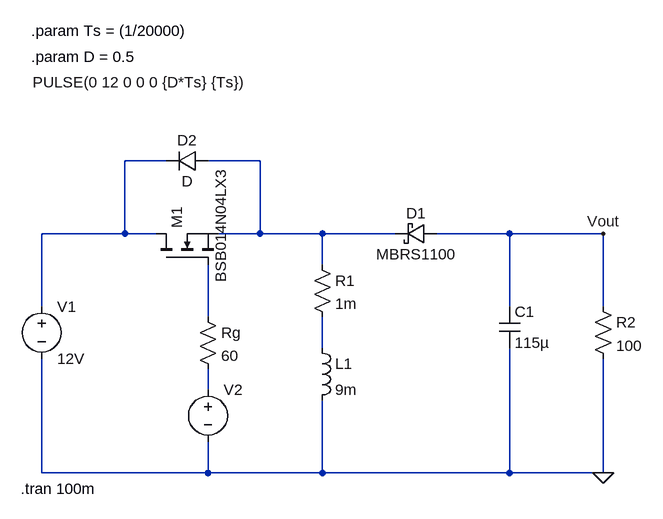
[diagram p0: schematic BuckBoost_gizemfiliz.asc]
BuckBoost_gizemfiliz.asc, the LTspice schematic file:
Version 4
SHEET 1 880 680
WIRE 128 -96 64 -96
WIRE 272 -96 192 -96
WIRE 64 16 64 -96
WIRE 64 16 -64 16
WIRE 112 16 64 16
WIRE 272 16 272 -96
WIRE 272 16 208 16
WIRE 368 16 272 16
WIRE 480 16 368 16
WIRE 656 16 544 16
WIRE 800 16 656 16
WIRE 368 64 368 16
WIRE -64 128 -64 16
WIRE 656 128 656 16
WIRE 800 128 800 16
WIRE 192 144 192 64
WIRE 368 192 368 144
WIRE 192 256 192 224
WIRE -64 384 -64 208
WIRE 192 384 192 336
WIRE 192 384 -64 384
WIRE 368 384 368 272
WIRE 368 384 192 384
WIRE 656 384 656 192
WIRE 656 384 368 384
WIRE 800 384 800 208
WIRE 800 384 656 384
FLAG 800 384 0
FLAG 800 16 Vout
SYMBOL voltage -64 112 R0
WINDOW 123 0 0 Left 0
WINDOW 39 0 0 Left 0
SYMATTR InstName V1
SYMATTR Value 12V
SYMBOL nmos 112 64 R270
WINDOW 3 -27 100 Left 2
SYMATTR Value BSB014N04LX3
SYMATTR InstName M1
SYMBOL voltage 192 240 R0
WINDOW 3 -270 -457 Left 2
WINDOW 123 0 0 Left 0
WINDOW 39 0 0 Left 0
SYMATTR Value PULSE(0 12 0 0 0 {D*Ts} {Ts})
SYMATTR InstName V2
SYMBOL res 352 48 R0
SYMATTR InstName R1
SYMATTR Value 1m
SYMBOL ind 352 176 R0
SYMATTR InstName L1
SYMATTR Value 9m
SYMBOL schottky 544 0 R90
WINDOW 0 0 32 VBottom 2
WINDOW 3 32 32 VTop 2
SYMATTR InstName D1
SYMATTR Value MBRS1100
SYMATTR Description Diode
SYMATTR Type diode
SYMBOL cap 640 128 R0
SYMATTR InstName C1
SYMATTR Value 115µ
SYMBOL res 784 112 R0
SYMATTR InstName R2
SYMATTR Value 100
SYMBOL diode 192 -112 R90
WINDOW 0 0 32 VBottom 2
WINDOW 3 32 32 VTop 2
SYMATTR InstName D2
SYMBOL res 176 128 R0
SYMATTR InstName Rg
SYMATTR Value 60
TEXT -96 408 Left 2 !.tran 100m
TEXT -80 -256 Left 2 !.param D = 0.5
TEXT -80 -296 Left 2 !.param Ts = (1/20000)

The netlist it stands for:
* BuckBoost_gizemfiliz.asc
V1 N001 0 12V
M1 N001 N003 N002 N002 BSB014N04LX3
V2 N005 0 PULSE(0 12 0 0 0 {D*Ts} {Ts})
R1 N002 N004 1m
L1 N004 0 9m
D1 Vout N002 MBRS1100
C1 Vout 0 115µ
R2 Vout 0 100
D2 N002 N001 D
Rg N003 N005 60
.model D D
.lib standard.dio
.model NMOS NMOS
.model PMOS PMOS
.lib standard.mos
.tran 100m
.param D = 0.5
.param Ts = (1/20000)
.backanno
.end